# EAGLE design Modulo_shield_L6470-36 (EAGLE 7.6.0)
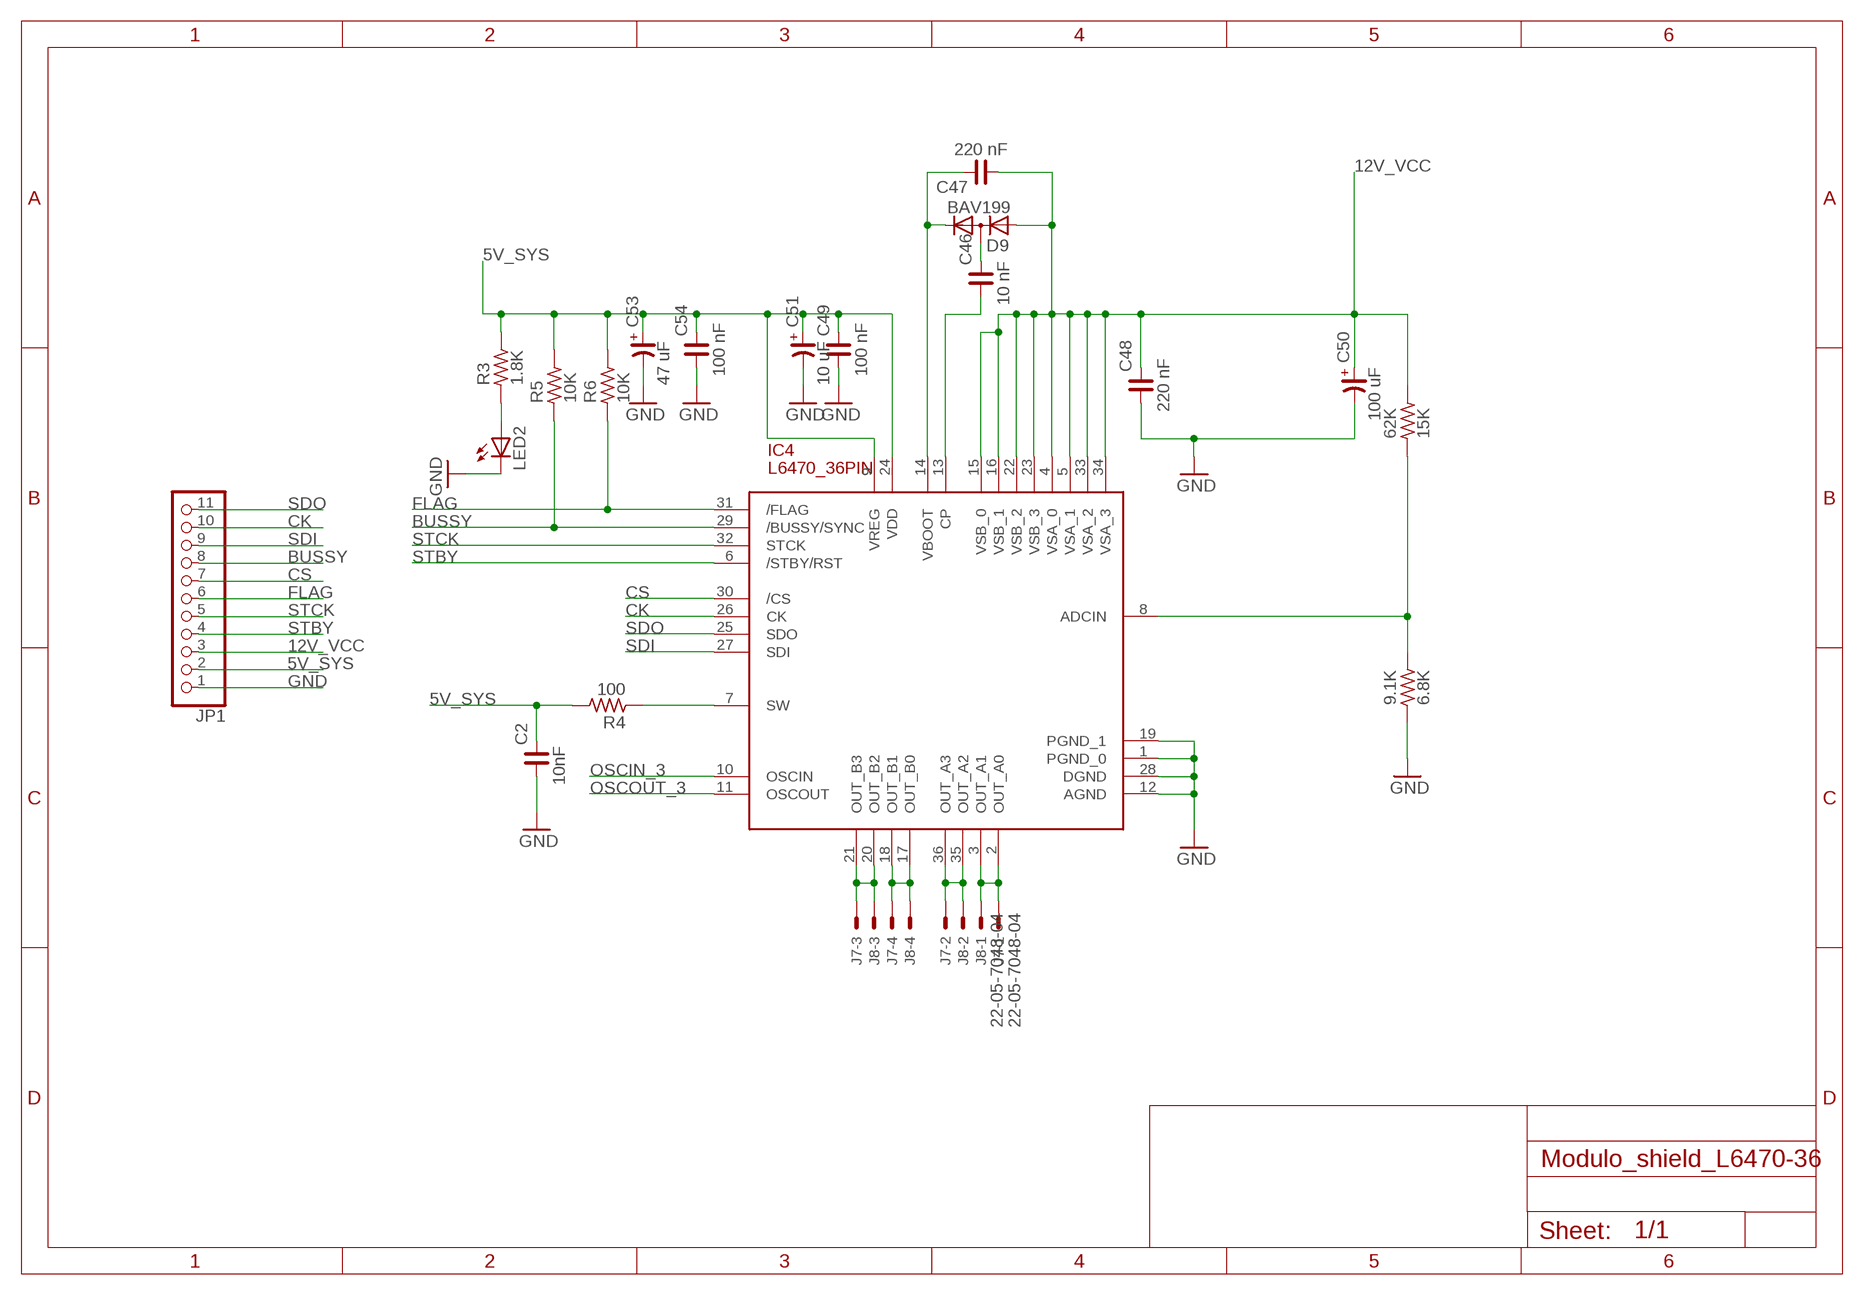
[diagram p0: schematic, sheet 1]

## Parts
9.1K  6.8K  R_1206  [R1206]
62K  15K  R_1206  [R1206]
C2  10nF  C_1206  [C1206]
C46  10 nF  C_1206  [C1206]
C47  220 nF  C_1206  [C1206]
C48  220 nF  C_1206  [C1206]
C49  100 nF  C_1206  [C1206]
C50  100 uF  CP_SV-D  [CSV-D]
C51  10 uF  CP_SV-B  [CSV-B]
C53  47 uF  CP_SV-B  [CSV-B]
C54  100 nF  C_1206  [C1206]
D9  BAV199  [SOT23]
IC4  L6470_36PIN  [L6470_36PIN]
J7  22-05-7048-04  [7395-04]
J8  22-05-7048-04  [7395-04]
JP1  PINHD-1X11/90  [1X11/90]
LED2  LEDCHIPLED_1206  [CHIPLED_1206]
R3  1.8K  R_1206  [R1206]
R4  100  R_1206  [R1206]
R5  10K  R_1206  [R1206]
R6  10K  R_1206  [R1206]

## Nets
5V_SYS: C2.2 C49.2 C51.+ C53.+ C54.2 IC4.9(VREG) IC4.24(VDD) JP1.2 R3.2 R4.2 R5.2 R6.2
12V_VCC: 62K.2 C47.1 C48.2 C50.+ D9.1(A) IC4.4(VSA_0) IC4.5(VSA_1) IC4.15(VSB_0) IC4.16(VSB_1) IC4.22(VSB_2) IC4.23(VSB_3) IC4.33(VSA_2) IC4.34(VSA_3) JP1.3
BUSSY: IC4.29(/BUSSY/SYNC) JP1.8 R5.1
CK: IC4.26(CK) JP1.10
CS: IC4.30(/CS) JP1.7
FLAG: IC4.31(/FLAG) JP1.6 R6.1
GND: 9.1K.1 C2.1 C48.1 C49.1 C50.- C51.- C53.- C54.1 IC4.1(PGND_0) IC4.12(AGND) IC4.19(PGND_1) IC4.28(DGND) JP1.1 LED2.C
N$1: IC4.2(OUT_A0) IC4.3(OUT_A1) J7.1 J8.1
N$2: IC4.20(OUT_B2) IC4.21(OUT_B3) J7.3 J8.3
N$3: LED2.A R3.1
N$4: IC4.7(SW) R4.1
N$5: IC4.35(OUT_A2) IC4.36(OUT_A3) J7.2 J8.2
N$7: IC4.17(OUT_B0) IC4.18(OUT_B1) J7.4 J8.4
N$56: C46.2 D9.3(AC)
N$57: C46.1 IC4.13(CP)
N$63: C47.2 D9.2(C) IC4.14(VBOOT)
N$64: 9.1K.2 62K.1 IC4.8(ADCIN)
OSCIN_3: IC4.10(OSCIN)
OSCOUT_3: IC4.11(OSCOUT)
SDI: IC4.27(SDI) JP1.9
SDO: IC4.25(SDO) JP1.11
STBY: IC4.6(/STBY/RST) JP1.4
STCK: IC4.32(STCK) JP1.5

## Library data of the parts
9.1K 62K R3-R6 = tesis-master-smd:R_: RESISTOR
C2 C46-C49 C54 = tesis-master-smd:C_: NON-POLARIZED CAP
C50 C51 C53 = tesis-master-smd:CP_: POLARIZED CAP
D9 = diode:BAV199: DIODE low-leakage double diode
IC4 = L6470_36PIN:L6470_36PIN
J7 J8 = tesis-Replicape_B3:22-?-04: CONNECTOR wire to board 2.54 mm (.1 inch) pitch header; OC_FARNELL: unknown; OC_NEWARK: unknown
JP1 = pinhead:PINHD-1X11: PIN HEADER
LED2 = tesis-Replicape_B3:LED: LED OSRAM: - CHIPLED LG R971, LG N971, LY N971, LG Q971, LY Q971, LO R971, LY R971 LH N974, LH R974 LS Q976, LO Q976, LY Q976 LO Q996 - Hyper CHIPLED LW Q18S LB Q993, LB Q99A, LB R99A - SideLED LS A670, LO A670, LY A670, LG A670, LP A670 LB A673, LV A673, LT A673, LW A673 LH A674 LY A675 LS A676, LA A676, LO A676, LY A676, LW A676 LS A679, LY A679, LG A679 - Hyper Micro SIDELED® LS Y876, LA Y876, LO Y876, LY Y876 LT Y87S - SmartLED LW L88C, LW L88S LB L89C, LB L89S, LG L890 LS L89K, LO L89K, LY L89K LS L896, LA L896, LO L896, LY L896 - TOPLED LS T670, LO T670, LY T670, LG T670, LP T670 LSG T670, LSP T670, LSY T670, LOP T670, LYG T670 LG T671, LOG T671, LSG T671 LB T673, LV T673, LT T673, LW T673 LH T674 LS T676, LA T676, LO T676, LY T676, LB T676, LH T676, LSB T676, LW T676 LB T67C, LV T67C, LT T67C, LS T67K, LO T67K, LY T67K, LW E67C LS E67B, LA E67B, LO E67B, LY E67B, LB E67C, LV E67C, LT E67C LW T67C LS T679, LY T679, LG T679 LS T770, LO T770, LY T770, LG T770, LP T770 LB T773, LV T773, LT T773, LW T773 LH T774 LS E675, LA E675, LY E675, LS T675 LS T776, LA T776, LO T776, LY T776, LB T776 LHGB T686 LT T68C, LB T68C - Hyper Mini TOPLED® LB M676 - Mini TOPLED Santana® LG M470 LS M47K, LO M47K, LY M47K Source: http://www.osram.convergy.de LUXEON: - LUMILED® LXK2-PW12-R00, LXK2-PW12-S00, LXK2-PW14-U00, LXK2-PW14-V00 LXK2-PM12-R00, LXK2-PM12-S00, LXK2-PM14-U00 LXK2-PE12-Q00, LXK2-PE12-R00, LXK2-PE12-S00, LXK2-PE14-T00, LXK2-PE14-U00 LXK2-PB12-K00, LXK2-PB12-L00, LXK2-PB12-M00, LXK2-PB14-N00, LXK2-PB14-P00, LXK2-PB14-Q00 LXK2-PR12-L00, LXK2-PR12-M00, LXK2-PR14-Q00, LXK2-PR14-R00 LXK2-PD12-Q00, LXK2-PD12-R00, LXK2-PD12-S00 LXK2-PH12-R00, LXK2-PH12-S00 LXK2-PL12-P00, LXK2-PL12-Q00, LXK2-PL12-R00 Source: www.luxeon.com KINGBRIGHT: KA-3528ASYC Source: www.kingbright.com

## Board
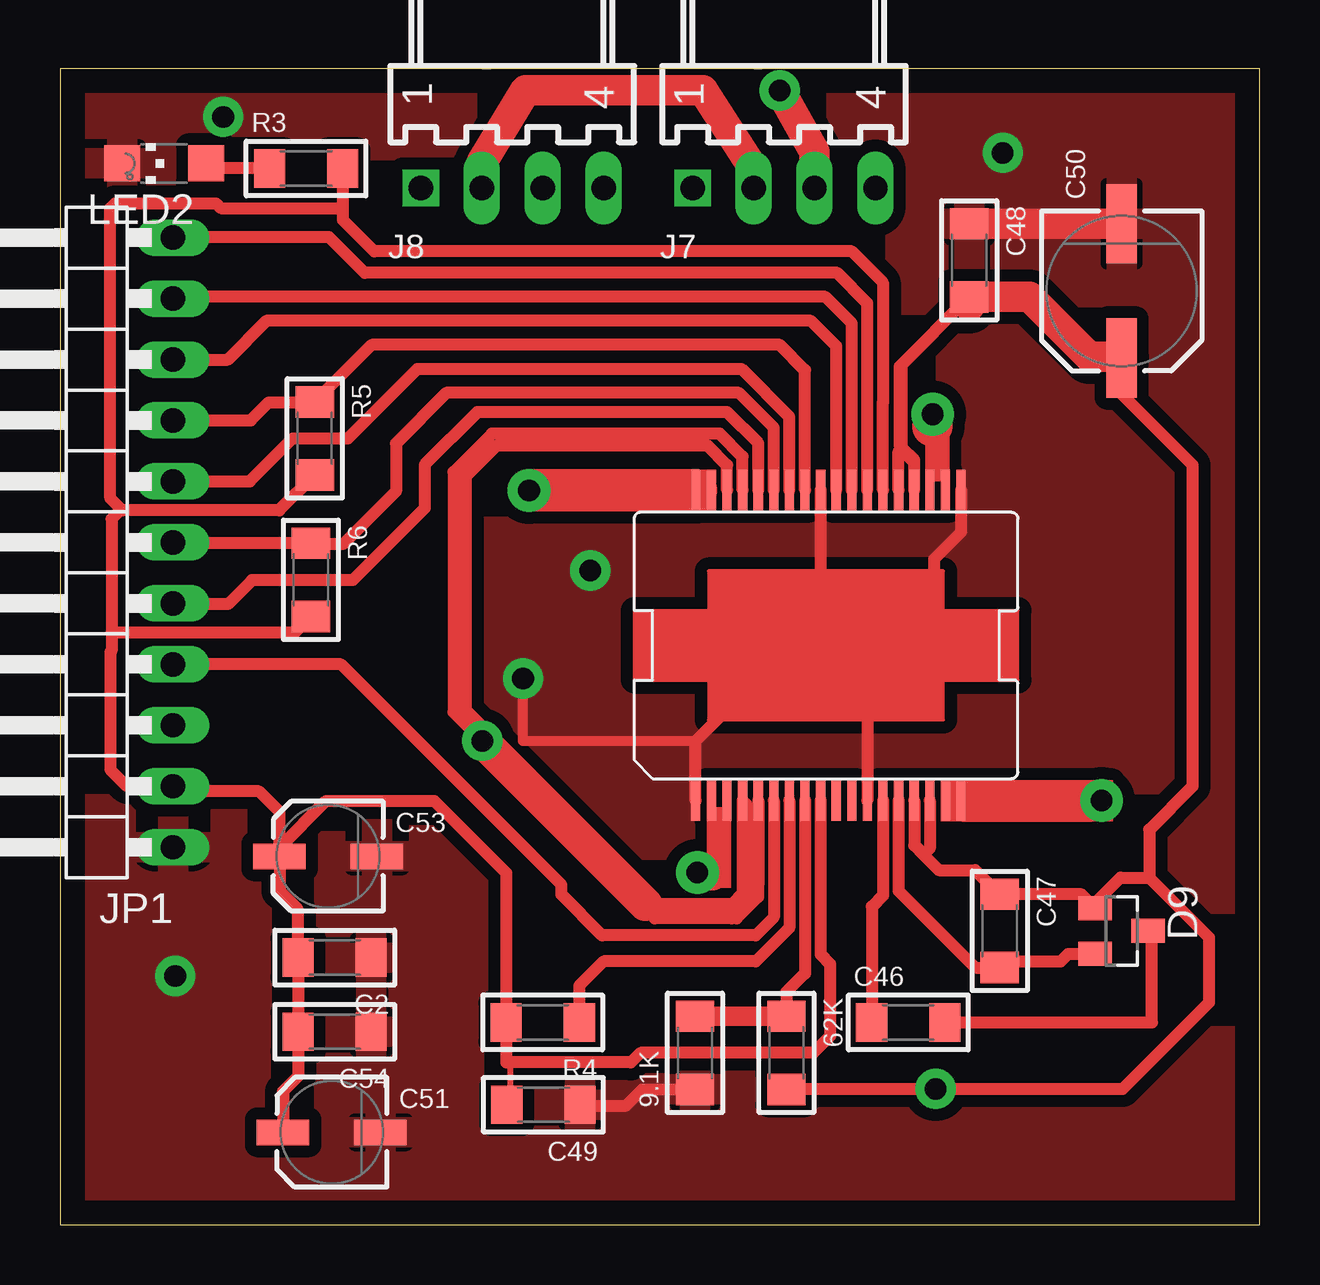
[diagram p1: board, top side]
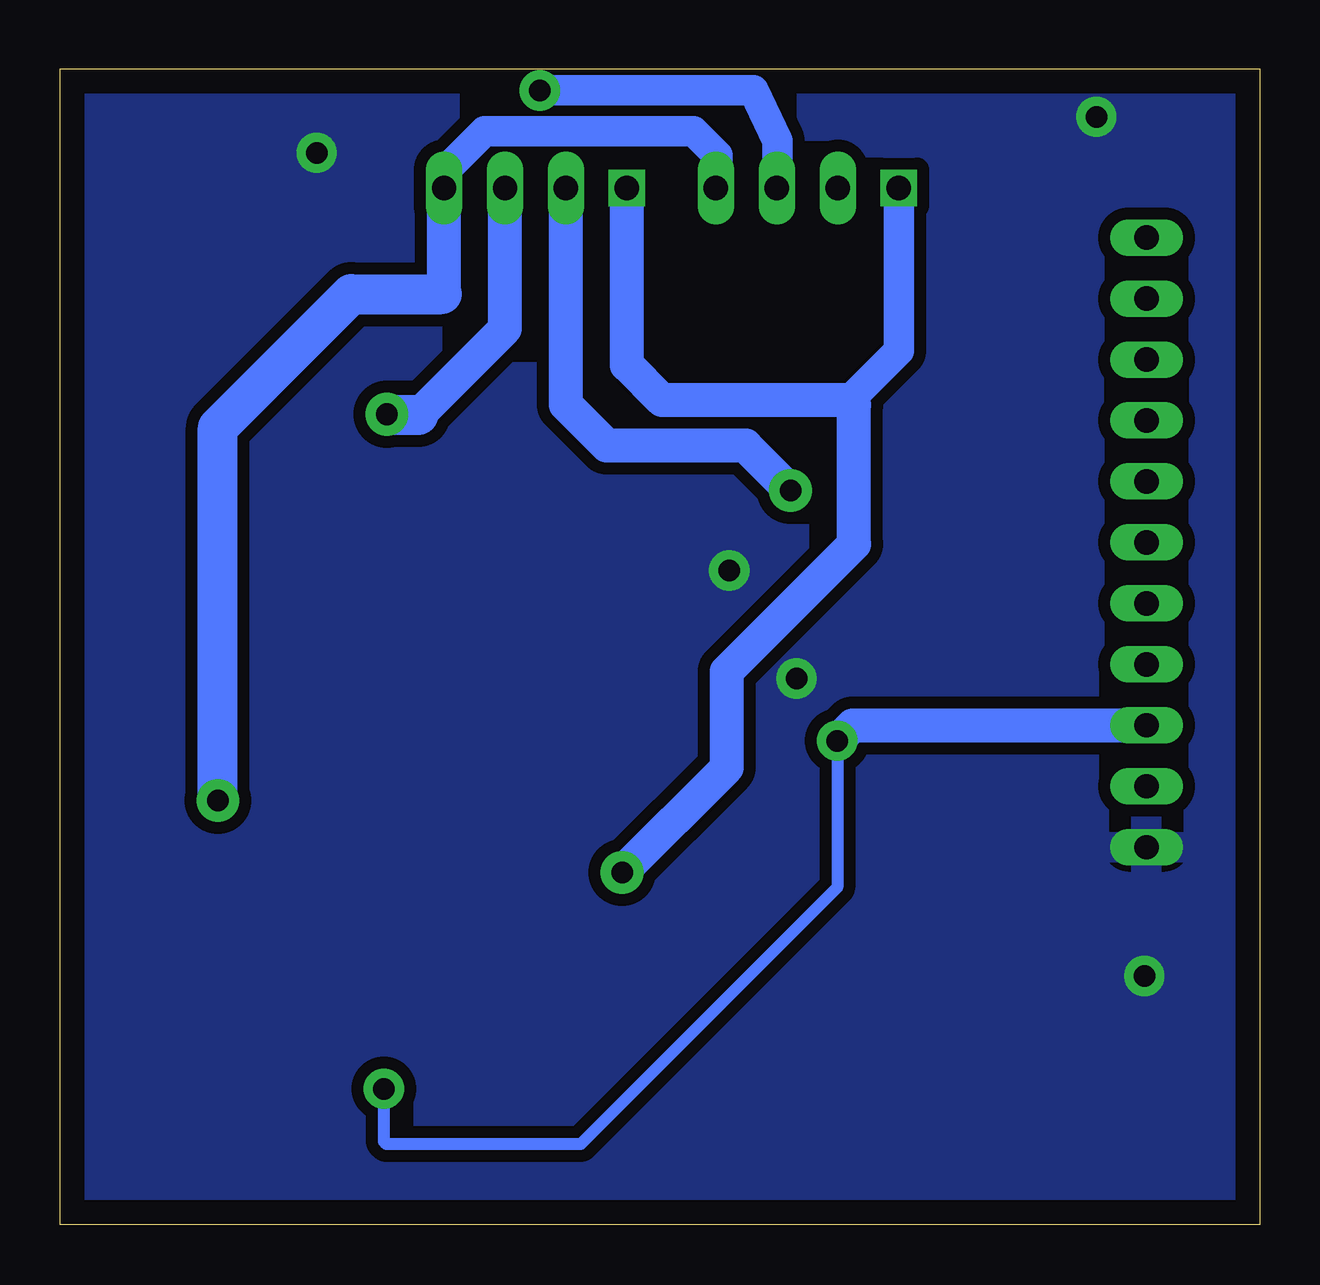
[diagram p2: board, bottom side, seen from below]

Size 50 x 48.16 mm. Coordinates in mm from the lower left corner, seen from the top.
Outline: 0,0 50,0 50,48.16 0,48.16 0,0
Copper layers (1*16): Top 0.035mm / dielectric 1.5mm / Bottom 0.035mm
Design rules "default *": minimum track width 10mil, minimum drill 24mil, track to track 0.5mm, track to pad 0.5mm, pad to pad 0.5mm, via to via 0.5mm, smd to smd 0.5mm, copper to edge 40mil, drill to drill 8mil, minimum pad ring 10mil, minimum via ring 8mil, stop-mask expansion 4mil, vias tented up to drill 0mil, thermal gap 10mil

### Footprints (pad centres in the part's own frame; a part is rotated, then mirrored left to right if it is on the bottom)
R1206 = smd 1.3 x 1.6: 1 -1.524,0; 2 1.524,0
C1206 = smd 1.3 x 1.6: 1 -1.524,0; 2 1.524,0
CSV-D = smd 3.302 x 1.27: + -2.794,0; - 2.794,0
CSV-B = smd 2.184 x 1.067: + -2.032,0; - 2.032,0
SOT23 = smd 1 x 1.4: 1 -0.95,-1.1; 2 0.95,-1.1; 3 0,1.1
L6470_36PIN = smd 0.38 x 1.7: 1 2.567,-0.916; 2 3.226,-0.916; 3 3.876,-0.916; 4 4.526,-0.916; 5 5.176,-0.916; 6 5.826,-0.916; 7 6.476,-0.916; 8 7.126,-0.916; 9 7.776,-0.916; 10 8.426,-0.916; 11 9.076,-0.916; 12 9.726,-0.916; 13 10.376,-0.916; 14 11.026,-0.916; 15 11.676,-0.916; 16 12.326,-0.916; 17 12.976,-0.916; 18 13.626,-0.916; 19 13.626,12.015; 20 12.976,12.015; 21 12.326,12.015; 22 11.676,12.015; 23 11.026,12.015; 24 10.376,12.015; 25 9.726,12.015; 26 9.076,12.015; 27 8.426,12.015; 28 7.776,12.015; 29 7.126,12.015; 30 6.476,12.015; 31 5.826,12.015; 32 5.176,12.015; 33 4.526,12.015; 34 3.876,12.015; 35 3.226,12.015; 36 2.576,12.015
7395-04 = drill 1.016 square: 1 3.81,0 | drill 1.016 long: 2 1.27,0; 3 -1.27,0; 4 -3.81,0
1X11/90 = drill 1.016 long: 1 -12.7,-3.81; 2 -10.16,-3.81; 3 -7.62,-3.81; 4 -5.08,-3.81; 5 -2.54,-3.81; 6 0,-3.81; 7 2.54,-3.81; 8 5.08,-3.81; 9 7.62,-3.81; 10 10.16,-3.81; 11 12.7,-3.81
CHIPLED_1206 = smd 1.5 x 1.5: A 0,-1.75; C 0,1.75

### Placement (x,y rotation side)
9.1K  26.47,7.16 90 top
62K  30.28,7.16 270 top
C2  11.45,11.13 180 top
C46  35.36,8.43 0 top
C47  39.17,12.24 270 top
C48  37.9,40.18 270 top
C49  20.15,5 180 top
C50  44.25,38.91 90 top
C51  11.33,3.85 0 top
C53  11.18,15.35 0 top
C54  11.45,8.04 180 top
D9  44.25,12.24 270 top
IC4  23.93,18.59 0 top
J7  30.18,43.2 180 top
J8  18.85,43.2 180 top
JP1  0.9,28.43 90 top
LED2  4.34,44.22 90 top
R3  10.26,44.01 0 top
R4  20.12,8.43 180 top
R5  10.62,32.76 270 top
R6  10.46,26.87 270 top

### Tracks (layer width: path | path; a pad name or v marks a point on that pad's centre or on a via)
5V_SYS
  Top 0.254: C49.2 18.75,5.16 18.75,6.66 18.6,6.76
  Top 0.5: C51.+ 9.3,5.56 9.93,6.19 C54.2 C2.2 9.9,11.16 9.9,13.16 9.15,13.91 C53.+ 9.15,15.71 | 18.6,5.03 C49.2 | 9.15,15.71 11.1,17.66 15.6,17.66 18.6,14.66 R4.2 18.6,6.76 23.8,6.76 24.2,7.16 31.4,7.16 32.1,7.86 32.1,10.86 31.7,11.26 IC4.9 | IC4.24 34.31,34.25 34.3,34.26 34.3,39.26 33,40.56 13.1,40.56 11.8,41.86 11.8,42.36 | 11.8,42.36 11.8,43.99 R3.2 | 9.15,15.71 9.15,17.21 8.3,18.06 4.92,18.06 JP1.2 2.79,18.27 2.1,18.96 2.1,23.86 2.15,23.91 2.15,24.66 | R6.2 9.77,24.66 2.15,24.66 | 2.6,29.76 2.5,29.76 2.15,29.41 2.15,24.66 | R5.2 9.14,29.76 2.6,29.76 | 2.6,29.76 2.1,30.26 2.1,42.36 2.3,42.56 6.5,42.56 6.7,42.36 11.8,42.36
12V_VCC  (via drill 0.9 pad 1.68)
  Top 0.5: IC4.15 35.61,15.8 35.99,15.41 | 35.99,15.41 36.63,14.78 38.15,14.78 C47.1 42.58,13.76 D9.1 43.15,13.41 44.2,14.46 45.4,14.46 | IC4.16 36.26,15.68 35.99,15.41 | 35.1,32.36 35.61,31.85 IC4.22 35.61,31.75 35.1,32.26 35.1,35.86 37.6,38.36 40,38.36 40.3,38.66 40.4,38.66 42.9,36.16 44,36.16 44.1,36.06 44.1,34.76 47.2,31.66 47.2,18.26 45.4,16.46 45.4,14.46 | 35.1,32.36 35,32.46 35,35.76 C48.2 | IC4.23 34.96,32.22 35.1,32.36 | 24.4,13.36 28,13.36 28.46,13.82 IC4.4 28.6,17.53 28.6,13.86 28,13.26 28,13.16 | 28.2,12.76 29.1,13.66 IC4.5 29.11,14.17 28.8,13.86 28.7,13.86 28,13.16 | 28.2,12.76 28,12.76 | 28,12.76 24.8,12.76 | 28,13.16 28,12.76 | 28.2,12.76 27.9,13.06 24.9,13.06 | 62K.2 30.3,5.66 v36.5,5.66 44.3,5.66 47.9,9.26 47.9,11.96 45.4,14.46 | 28,13.16 24.6,13.16 v17.6,20.16 | IC4.33 28.46,32 27.5,32.96 18,32.96 16.4,31.36 16.4,21.36 v17.6,20.16 | IC4.34 27.81,31.65 27,32.46 18.2,32.46 16.9,31.16 16.9,21.46 17.7,20.66 17.7,20.26 v17.6,20.16
  Top 1.27: C50.+ 44.21,36.16 42.9,36.16 40.4,38.66 C48.2 37.9,38.26
  Top 1.422: 24.4,13.36 v17.6,20.16
  Bottom 0.5: v17.6,20.16 17.6,14.06 28.3,3.36 36.4,3.36 36.5,3.46 v36.5,5.66
  Bottom 1.422: v17.6,20.16 16.95,20.81 JP1.3
BUSSY
  Top 0.5: IC4.29 31.06,35.6 30,36.66 13,36.66 R5.1 10.6,34.26 8.7,34.26 7.95,33.51 JP1.8
CK
  Top 0.5: IC4.26 33.01,37.55 31.9,38.66 4.78,38.66 JP1.10
CS
  Top 0.5: IC4.30 30.41,33.65 28.4,35.66 14.9,35.66 12,32.76 9.7,32.76 7.91,30.97 JP1.7
FLAG
  Top 0.5: IC4.31 29.76,33.2 28.3,34.66 16.1,34.66 14,32.56 14,30.56 11.8,28.36 10.49,28.36 R6.1 4.75,28.39 JP1.6
GND  (via drill 0.9 pad 1.68)
  Top 0.406: 26.5,20.15 19.3,20.15 v19.3,22.76
  Top 0.5: IC4.28 31.71,25.98 31.98,25.71 | 31.98,25.71 33.66,24.03 | 33.66,24.03 IC4.12 | IC4.1 26.5,20.15 28.36,22.01 28.36,22.1 31.98,25.71 | IC4.19 37.56,28.86 36.43,27.73 36.43,25.14 35.32,24.03 33.66,24.03 | C49.1 arc90 21.71,4.96 23.6,4.96 24.28,5.64 9.1K.1
  Top 1.27: C48.1 C50.-
  other vias: 6.8,46.16 39.3,44.66 22.1,27.26 4.8,10.36
  pour Bottom: 0,0.16 50,0.16 50,50.16 0,50.16
  pour Top: 0,0.16 50,0.16 50,50.16 0,50.16
N$1  (via drill 0.9 pad 1.78)
  Top 0: v26.57,14.68 27.47,15.76 27.76,16.05 | IC4.2 27.16,16.45 27.22,16.39 27.7,16.39 27.76,16.33
  Top 0.254: IC4.3 27.76,17.63 27.76,16.33 27.76,16.05 27.76,14.54 27.6,14.38
  Top 1.27: v26.57,14.68 26.69,14.56 27.2,14.56
  Bottom 1.27: J8.1 15.04,36.42 17.1,34.36
  Bottom 1.422: v26.57,14.68 22.2,19.05 22.2,23.06 16.9,28.36 16.9,34.16 17.1,34.36 24.9,34.36 26.37,35.83 J7.1
N$2  (via drill 0.9 pad 1.68, 0.9 pad 1.78)
  Top 0.254: IC4.21 36.35,33.26 v36.37,33.77 IC4.20
  Top 1.27: J7.3 31.45,44.71 v30,47.26
  Top 1.676: v36.37,33.77 36.37,33.28 36.35,33.26
  Bottom 1.27: v30,47.26 21.1,47.26 20.1,45.16 20.1,43.22 J8.3
  Bottom 1.422: 35.06,33.73 31.45,37.34 J7.3
  Bottom 1.676: 35.06,33.73 36.33,33.73 v36.37,33.77
N$3
  Top 0.5: R3.1 6.3,44.01 LED2.A
N$4
  Top 0.5: IC4.7 30.41,12.37 29.01,10.97 22.66,10.97 21.64,9.95 R4.1
N$5  (via drill 0.9 pad 1.78)
  Top 0.406: IC4.35 IC4.36
  Top 1.27: J7.2 28.8,43.31 28.8,44.16 26.8,47.26 19.4,47.26 17.58,44.24 J8.2
  Top 1.778: IC4.36 19.54,30.61 v19.55,30.59
  Bottom 1.422: v19.55,30.59 21.42,32.46 27.2,32.46 28.91,34.17 J7.2
N$7  (via drill 0.9 pad 1.78)
  Top 0.254: IC4.18 IC4.17 36.93,17.66 36.93,17.67 36.85,17.75 43.35,17.75 v43.42,17.68
  Top 1.676: IC4.18 37.6,17.63 43.02,17.63
  Bottom 1.27: J7.4 33.99,43.87 32.3,45.56 23.6,45.56 22.6,44.56 22.6,43.26 J8.4
  Bottom 1.422: 34.09,38.77 33.99,38.87 J7.4
  Bottom 1.676: v43.42,17.68 43.42,33.21 37.86,38.77 34.09,38.77
N$56
  Top 0.5: C46.2 45.52,8.43 45.52,12.07 arc90 D9.3
N$57
  Top 0.5: IC4.13 34.31,13.73 33.84,13.26 C46.1
N$63
  Top 0.5: IC4.14 34.96,13.91 38.15,10.72 C47.2 39.42,10.97 41.71,10.97 42.03,11.29 D9.2
N$64
  Top 0.5: IC4.8 31.06,10.48 30.28,9.7 62K.1
  Top 0.813: 9.1K.2 62K.1
SDI
  Top 0.5: IC4.27 32.36,36.6 31.3,37.66 8.6,37.66 6.99,36.05 JP1.9
SDO
  Top 0.254: 4.75,41.16 JP1.11
  Top 0.5: IC4.25 33.66,38.4 32.4,39.66 12.7,39.66 11.2,41.16 4.75,41.16 4.74,41.16
STBY
  Top 0.5: IC4.6 29.76,12.82 29,12.06 22.6,12.06 20.9,13.76 20.9,14.16 11.71,23.35 JP1.4
STCK
  Top 0.5: 29.11,32.35 IC4.32 29.11,32.55 27.8,33.86 17.4,33.86 15.2,31.66 15.2,29.86 12.2,26.86 8,26.86 7,25.86 4.74,25.86 JP1.5
(copper drawn outside any net)
  shapes: Top area x4